# Altium schematic sheet TempPres.SchDoc
size A
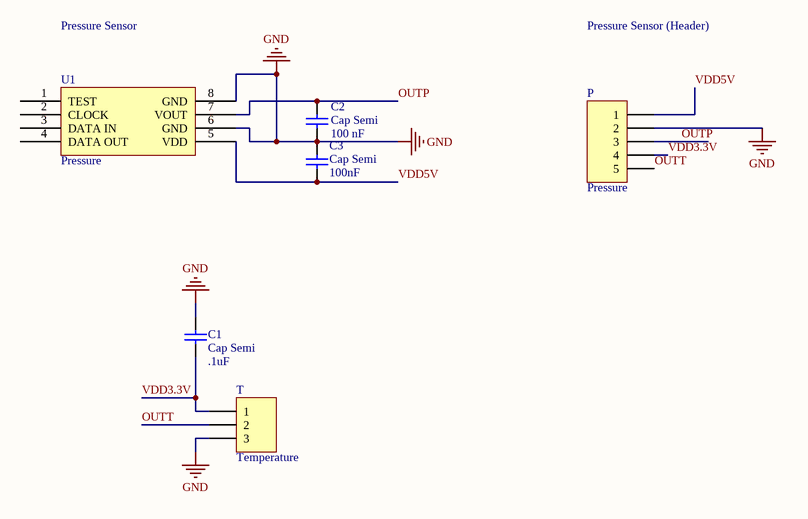
[diagram p0: TempPres.SchDoc]

## Parts
C1  Cap Semi  value .1uF  [C1206]
C2  Cap Semi  value 100 nF  [C1206]
C3  Cap Semi  value 100nF  [C1206]
P  Pressure  [HDR1X5]
T  Temperature  [HDR1X3]
U1  Pressure  [KP-234]

## Nets
GND: C1.2 C2.1 C3.2 P.2 T.3 U1.6(GND) U1.8(GND)
OUTP: C2.2 P.3 U1.7(VOUT)
OUTT: P.5 T.2
VDD3.3V: C1.1 P.4 T.1
VDD5V: C3.1 P.1 U1.5(VDD)

Not connected (* = marked no-connect by the designer): U1 1(TEST) 2(CLOCK) 3(DATA_IN) 4(DATA_OUT)

## Notes on the sheet
- Pressure Sensor
- Pressure Sensor (Header)

## Library data of the parts
C1-C3 = Cap Semi: Capacitor (Semiconductor SIM Model); Published: 8-Jun-2000; LatestRevisionDate: 29-May-2009; LatestRevisionNote: IPC-7351 Footprint Added.; PackageReference: C1206; Publisher: Altium Limited; PackageDescription: Chip Capacitor
P = Header 5H: Header, 5-Pin, Right Angle; LatestRevisionDate: 17-Jul-2002; LatestRevisionNote: Re-released for DXP Platform.; Publisher: Altium Limited
T = Header 3: Header, 3-Pin; LatestRevisionDate: 17-Jul-2002; LatestRevisionNote: Re-released for DXP Platform.; Publisher: Altium Limited
U1 = Component_1